# Altium schematic sheet Gimbal.SchDoc
size A3
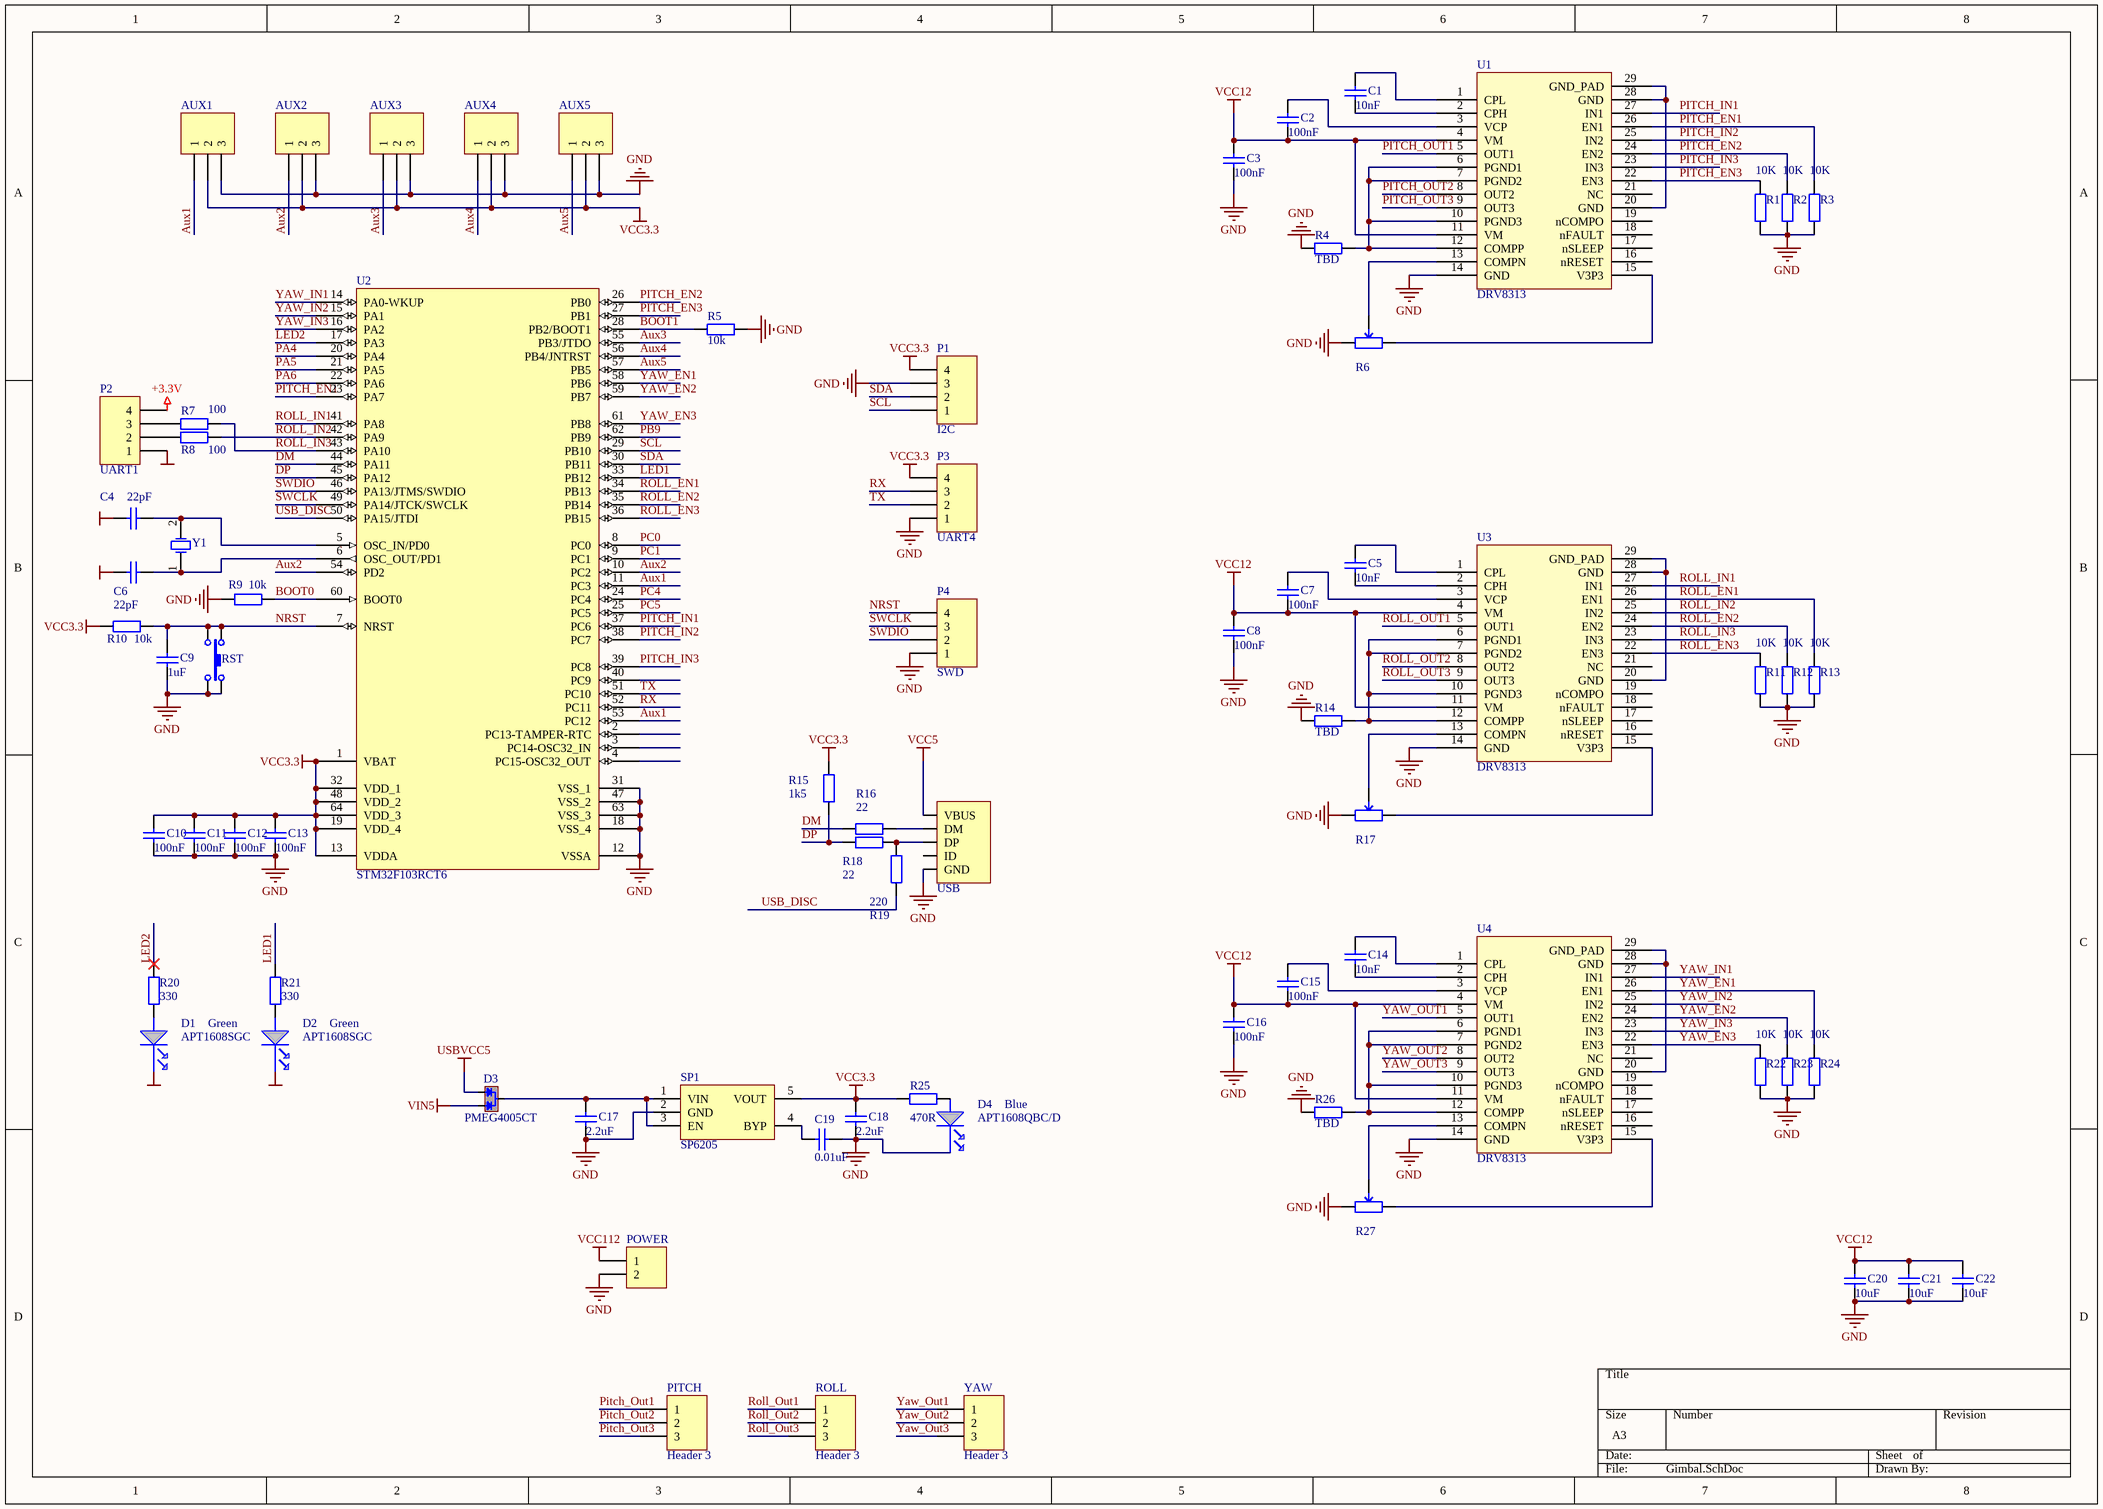
[diagram p0: Gimbal.SchDoc]

## Parts
AUX1  (no value)  [HDR1X3]
AUX2  (no value)  [HDR1X3]
AUX3  (no value)  [HDR1X3]
AUX4  (no value)  [HDR1X3]
AUX5  (no value)  [HDR1X3]
C1  value 10nF  [c-0603]  (hidden comment: Cap)
C2  value 100nF  [c-0603]  (hidden comment: Cap)
C3  value 100nF  [c-0603]  (hidden comment: Cap)
C4  22pF  [c-0603]
C5  value 10nF  [c-0603]  (hidden comment: Cap)
C6  22pF  [c-0603]
C7  value 100nF  [c-0603]  (hidden comment: Cap)
C8  value 100nF  [c-0603]  (hidden comment: Cap)
C9  value 1uF  [c-0603]  (hidden comment: CAP)
C10  value 100nF  [c-0603]  (hidden comment: CAP)
C11  value 100nF  [c-0603]  (hidden comment: CAP)
C12  value 100nF  [c-0603]  (hidden comment: CAP)
C13  value 100nF  [c-0603]  (hidden comment: CAP)
C14  value 10nF  [c-0603]  (hidden comment: Cap)
C15  value 100nF  [c-0603]  (hidden comment: Cap)
C16  value 100nF  [c-0603]  (hidden comment: Cap)
C17  value 2.2uF  [c-0603]  (hidden comment: Cap)
C18  value 2.2uF  [c-0603]  (hidden comment: Cap)
C19  value 0.01uF  [c-0603]  (hidden comment: Cap)
C20  value 10uF  [c-0603]  (hidden comment: Cap)
C21  value 10uF  [c-0603]  (hidden comment: Cap)
C22  value 10uF  [c-0603]  (hidden comment: Cap)
D1  APT1608SGC  value Green  [LED-0603-GREEN]
D2  APT1608SGC  value Green  [LED-0603-GREEN]
D3  PMEG4005CT  [SOT23-3]
D4  APT1608QBC/D  value Blue  [LED-0603-BLUE]
P1  I2C  [H53047-04]
P2  UART1  [H53047-04]
P3  UART4  [H53047-04]
P4  SWD  [H53047-04]
PITCH  Header 3  [IDC1-3M]
POWER  Header 2  [HDR1X2]  (value not drawn)
R1  value 10K  [R-0603]  (hidden comment: RES)
R2  value 10K  [R-0603]  (hidden comment: RES)
R3  value 10K  [R-0603]  (hidden comment: RES)
R4  TBD  [R-0603]
R5  10k  [R-0603]
R6  Res_VR_3  [RES_VR_3313J]  (value not drawn)
R7  100  [R-0603]
R8  100  [R-0603]
R9  10k  [R-0603]
R10  10k  [R-0603]
R11  value 10K  [R-0603]  (hidden comment: RES)
R12  value 10K  [R-0603]  (hidden comment: RES)
R13  value 10K  [R-0603]  (hidden comment: RES)
R14  TBD  [R-0603]
R15  1k5  [R-0603]
R16  22  [R-0603]
R17  Res_VR_3  [RES_VR_3313J]  (value not drawn)
R18  22  [R-0603]
R19  220  [r-0603]
R20  330  [R-0603]
R21  330  [R-0603]
R22  value 10K  [R-0603]  (hidden comment: RES)
R23  value 10K  [R-0603]  (hidden comment: RES)
R24  value 10K  [R-0603]  (hidden comment: RES)
R25  value 470R  [r-0603]  (hidden comment: Res)
R26  TBD  [R-0603]
R27  Res_VR_3  [RES_VR_3313J]  (value not drawn)
ROLL  Header 3  [IDC1-3M]
RST  BT_TACT_3.5*5_90  [ButtonTACT_3.5*3.55_90]  (value not drawn)
SP1  SP6205  [SOT23-5]
U1  DRV8313  [TSSOP-28P-C]
U2  STM32F103RCT6  [LQFP64_N]
U3  DRV8313  [TSSOP-28P-C]
U4  DRV8313  [TSSOP-28P-C]
USB  USB_Micro  [USB_Micro-AB]  (value not drawn)
Y1  XTAL  [XT_5032_2]  (value not drawn)
YAW  Header 3  [IDC1-3M]

## Nets
+3.3V: P2.4
GND: AUX1.3 AUX2.3 AUX3.3 AUX4.3 AUX5.3 C3.2 C4.2 C6.2 C8.2 C9.2 C10.2 C11.2 C12.2 C13.2 C16.2 C17.2 C18.2 C19.2 C20.2 C21.2 C22.2 D1.K(CATODE) D2.K(CATODE) D4.K(CATODE) P1.3 P2.1 P3.1 P4.1 POWER.2 R1.2 R2.2 R3.2 R4.2 R5.1 R6.1 R9.2 R11.2 R12.2 R13.2 R14.2 R17.1 R22.2 R23.2 R24.2 R26.2 R27.1 RST.2 RST.4 SP1.2(GND) U1.14(GND) U2.12(VSSA) U2.18(VSS_4) U2.31(VSS_1) U2.47(VSS_2) U2.63(VSS_3) U3.14(GND) U4.14(GND) USB.5(GND)
USBVCC5: D3.2(A2)
VCC3.3: AUX1.2 AUX2.2 AUX3.2 AUX4.2 AUX5.2 C10.1 C11.1 C12.1 C13.1 C18.1 P1.4 P3.4 R10.2 R15.1 R25.2 SP1.5(VOUT) U2.1(VBAT) U2.13(VDDA) U2.19(VDD_4) U2.32(VDD_1) U2.48(VDD_2) U2.64(VDD_3)
VCC5: USB.1(VBUS)
VCC12: C2.2 C3.1 C7.2 C8.1 C15.2 C16.1 C20.1 C21.1 C22.1 U1.4(VM) U1.11(VM) U3.4(VM) U3.11(VM) U4.4(VM) U4.11(VM)
VCC112: POWER.1
VIN5: D3.1(A1)
Aux1: AUX1.1 U2.11(PC3) U2.53(PC12)
Aux2: AUX2.1 U2.10(PC2) U2.54(PD2)
Aux3: AUX3.1 U2.55(PB3/JTDO)
Aux4: AUX4.1 U2.56(PB4/JNTRST)
Aux5: AUX5.1 U2.57(PB5)
BOOT0: R9.1 U2.60(BOOT0)
BOOT1: R5.2 U2.28(PB2/BOOT1)
DM: R16.1 U2.44(PA11)
DP: R15.2 R18.1 U2.45(PA12)
LED1: R21.1 U2.33(PB12)
LED2: R20.1 U2.17(PA3)
NRST: C9.1 P4.4 R10.1 RST.1 RST.3 U2.7(NRST)
PA4: U2.20(PA4)
PA5: U2.21(PA5)
PA6: U2.22(PA6)
PB9: U2.62(PB9)
PC0: U2.8(PC0)
PC1: U2.9(PC1)
PC4: U2.24(PC4)
PC5: U2.25(PC5)
PITCH_EN1: R3.1 U1.26(EN1) U2.23(PA7)
PITCH_EN2: R2.1 U1.24(EN2) U2.26(PB0)
PITCH_EN3: R1.1 U1.22(EN3) U2.27(PB1)
PITCH_IN1: U1.27(IN1) U2.37(PC6)
PITCH_IN2: U1.25(IN2) U2.38(PC7)
PITCH_IN3: U1.23(IN3) U2.39(PC8)
Pitch_Out1: PITCH.1 U1.5(OUT1)
Pitch_Out2: PITCH.2 U1.8(OUT2)
Pitch_Out3: PITCH.3 U1.9(OUT3)
ROLL_EN1: R13.1 U2.34(PB13) U3.26(EN1)
ROLL_EN2: R12.1 U2.35(PB14) U3.24(EN2)
ROLL_EN3: R11.1 U2.36(PB15) U3.22(EN3)
ROLL_IN1: U2.41(PA8) U3.27(IN1)
ROLL_IN2: R8.1 U2.42(PA9) U3.25(IN2)
ROLL_IN3: R7.1 U2.43(PA10) U3.23(IN3)
Roll_Out1: ROLL.1 U3.5(OUT1)
Roll_Out2: ROLL.2 U3.8(OUT2)
Roll_Out3: ROLL.3 U3.9(OUT3)
RX: P3.3 U2.52(PC11)
SCL: P1.1 U2.29(PB10)
SDA: P1.2 U2.30(PB11)
SWCLK: P4.3 U2.49(PA14/JTCK/SWCLK)
SWDIO: P4.2 U2.46(PA13/JTMS/SWDIO)
TX: P3.2 U2.51(PC10)
USB_DISC: R19.1 U2.50(PA15/JTDI)
YAW_EN1: R24.1 U2.58(PB6) U4.26(EN1)
YAW_EN2: R23.1 U2.59(PB7) U4.24(EN2)
YAW_EN3: R22.1 U2.61(PB8) U4.22(EN3)
YAW_IN1: U2.14(PA0-WKUP) U4.27(IN1)
YAW_IN2: U2.15(PA1) U4.25(IN2)
YAW_IN3: U2.16(PA2) U4.23(IN3)
Yaw_Out1: U4.5(OUT1) YAW.1
Yaw_Out2: U4.8(OUT2) YAW.2
Yaw_Out3: U4.9(OUT3) YAW.3
NetC1_1: C1.1 U1.1(CPL)
NetC1_2: C1.2 U1.2(CPH)
NetC2_1: C2.1 U1.3(VCP)
NetC4_1: C4.1 U2.5(OSC_IN/PD0) Y1.2
NetC5_1: C5.1 U3.1(CPL)
NetC5_2: C5.2 U3.2(CPH)
NetC6_1: C6.1 U2.6(OSC_OUT/PD1) Y1.1
NetC7_1: C7.1 U3.3(VCP)
NetC14_1: C14.1 U4.1(CPL)
NetC14_2: C14.2 U4.2(CPH)
NetC15_1: C15.1 U4.3(VCP)
NetC17_1: C17.1 D3.3(COM) SP1.1(VIN) SP1.3(EN)
NetC19_1: C19.1 SP1.4(BYP)
NetD1_A: D1.A(ANODE) R20.2
NetD2_A: D2.A(ANODE) R21.2
NetD4_A: D4.A(ANODE) R25.1
NetP2_2: P2.2 R8.2
NetP2_3: P2.3 R7.2
NetR4_1: R4.1 U1.6(PGND1) U1.7(PGND2) U1.10(PGND3) U1.12(COMPP)
NetR6_2: R6.2 U1.15(V3P3)
NetR6_3: R6.3 U1.13(COMPN)
NetR14_1: R14.1 U3.6(PGND1) U3.7(PGND2) U3.10(PGND3) U3.12(COMPP)
NetR16_2: R16.2 USB.2(DM)
NetR17_2: R17.2 U3.15(V3P3)
NetR17_3: R17.3 U3.13(COMPN)
NetR18_2: R18.2 R19.2 USB.3(DP)
NetR26_1: R26.1 U4.6(PGND1) U4.7(PGND2) U4.10(PGND3) U4.12(COMPP)
NetR27_2: R27.2 U4.15(V3P3)
NetR27_3: R27.3 U4.13(COMPN)
NetU1_20: U1.20(GND) U1.28(GND) U1.29(GND_PAD)
NetU3_20: U3.20(GND) U3.28(GND) U3.29(GND_PAD)
NetU4_20: U4.20(GND) U4.28(GND) U4.29(GND_PAD)

Not connected (* = marked no-connect by the designer): U1 16(nRESET) 17(nSLEEP) 18(nFAULT) 19(nCOMPO) 21(NC); U2 2(PC13-TAMPER-RTC) 3(PC14-OSC32_IN) 4(PC15-OSC32_OUT) 40(PC9); U3 16(nRESET) 17(nSLEEP) 18(nFAULT) 19(nCOMPO) 21(NC); U4 16(nRESET) 17(nSLEEP) 18(nFAULT) 19(nCOMPO) 21(NC); USB 4(ID)

## Library data of the parts
AUX1-AUX5 PITCH ROLL YAW = Header 3: Header, 3-Pin; LatestRevisionDate: 17-Jul-2002; LatestRevisionNote: Re-released for DXP Platform.; Publisher: Altium Limited
C1-C22 = CAP0805: Capacitor; Published: 8-Jun-2000; LatestRevisionDate: 17-Jul-2002; LatestRevisionNote: Re-released for DXP Platform.; PackageReference: CAPC2012L; Publisher: Altium Limited
  C4 C6: Value: 22pF
D1 D2 D4 = LED
D3 = PMEG4005CT: Dual Diode Command Cathode 500ma; ComponentLink2Description: Datasheet; LatestRevisionDate: 1-Nov-2010; LatestRevisionNote: Released OpenPilot Lib; Published: 1-Nov-2010; Publisher: The OpenPilot Project; Supplier 1: Digi-Key; Supplier Part Number 1: 568-6522-1-ND
P1-P4 = Header 4: 0530470410; LatestRevisionDate: 17-Jul-2002; LatestRevisionNote: Re-released for DXP Platform.; Publisher: Altium Limited
POWER = Header 2: Header, 2-Pin; LatestRevisionDate: 17-Jul-2002; LatestRevisionNote: Re-released for DXP Platform.; Publisher: Altium Limited
R1-R3 R11-R13 R15 R22-R24 = RES 0603 330R: Resistor; Power W: 0.1W; Tolerance: ?%; Resistance (Ohms): 1000; Category: Rasistors; Package / Case: 0603 (1608 Metric); Price 1k (Eur): 0.00231
  R15: Value: 1K5
R4 R5 R7-R10 R14 R20 R21 R26 = RES 0603 330R: Resistor; Value: 1K; Power W: 0.1W; Tolerance: ?%; Resistance (Ohms): 1000; Category: Rasistors; Package / Case: 0603 (1608 Metric); Price 1k (Eur): 0.00231
R6 R17 R27 = Res_VR_3: Resistor
R16 R18 = RES 0603 330R: Resistor; Value: 1K5; Power W: 0.1W; Tolerance: ?%; Resistance (Ohms): 1000; Category: Rasistors; Package / Case: 0603 (1608 Metric); Price 1k (Eur): 0.00231
R19 = Res: Resistor; Value: 330R; Published: 8-Jun-2000; LatestRevisionDate: 17-Jul-2002; LatestRevisionNote: Re-released for DXP Platform.; PackageReference: AXIAL-0.4; Publisher: Altium Limited; PackageDescription: Axial Device, Thru-Hole; 2 Leads; 0.4 in Pin Spacing
R25 = Res: Resistor; Published: 8-Jun-2000; LatestRevisionDate: 17-Jul-2002; LatestRevisionNote: Re-released for DXP Platform.; PackageReference: AXIAL-0.4; Publisher: Altium Limited; PackageDescription: Axial Device, Thru-Hole; 2 Leads; 0.4 in Pin Spacing
RST = BT_TACT_3.5*5_90: Switch
SP1 = SP6205: Power
U2 = STM32F103RBT6: STM32 ARM-based 32-bit MCU with 128 Kbytes Flash, 64-pin LQFP, Industrial Temperature; Published: 30-May-2008; DatasheetVersion: rev6, Mar-2008; PackageVersion: Mar-2008; PackageReference: LQFP64; Publisher: Altium Limited; PackageDescription: 64-Pin Low-Profile Quad Flat Pack, 10 x 10 mm Body, 0.5 mm Pitch (LQFP64); ComponentLink1Description: Manufacturer Link; ComponentLink1URL: www.st.com/stm32; ComponentLink2Description: Datasheet; ComponentLink2URL: http://www.st.com/stonline/products/literature/ds/13587.pdf
USB = USB_Micro: USB
Y1 = XTAL: VALUE: 8MHz